# EAGLE design Lemming2_sensors (EAGLE 8.0.0)
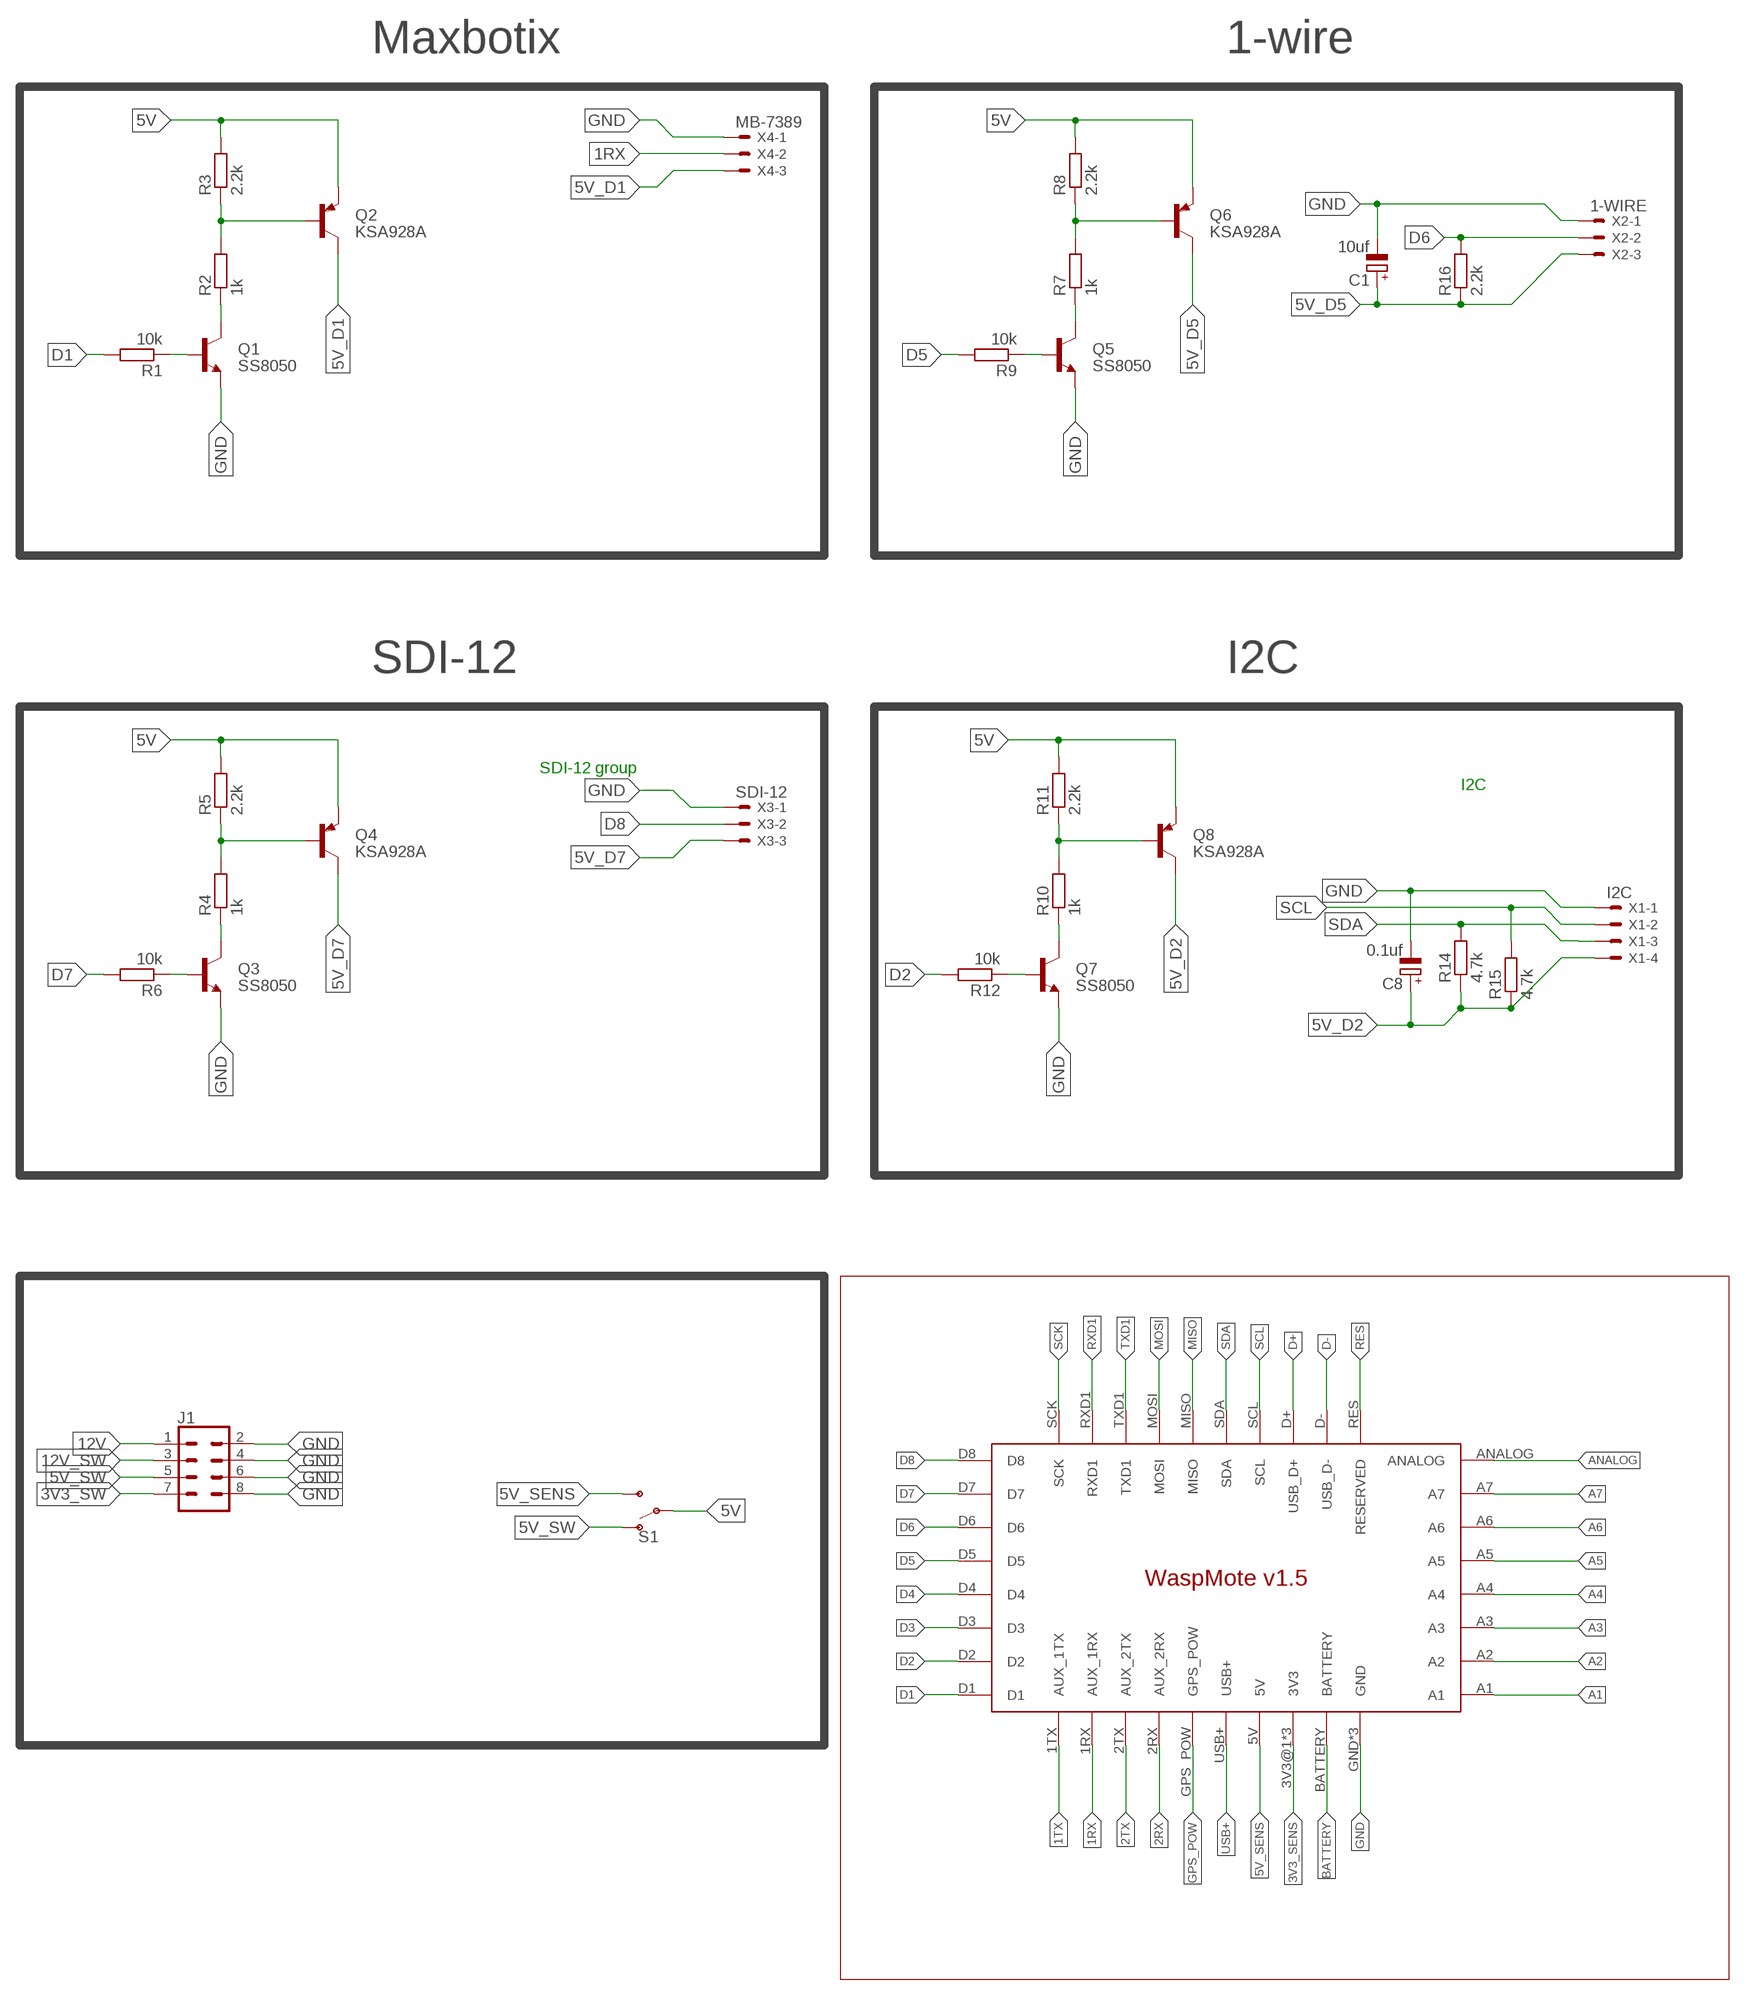
[diagram p0: schematic, sheet 1]

## Parts
C1  10uf  CPOL-EUE2.5-5  [E2,5-5]
C8  0.1uf  CPOL-EUE2.5-5  [E2,5-5]
J1  CONN_04X2  [2X4]
Q1  SS8050  [TO-92-EBC]
Q2  KSA928A  [TO-92-ECB]
Q3  SS8050  [TO-92-EBC]
Q4  KSA928A  [TO-92-ECB]
Q5  SS8050  [TO-92-EBC]
Q6  KSA928A  [TO-92-ECB]
Q7  SS8050  [TO-92-EBC]
Q8  KSA928A  [TO-92-ECB]
R1  10k  RESISTOR_R-EU_0309/10  [RESISTOR_0309/10]
R2  1k  RESISTOR_R-EU_0309/10  [RESISTOR_0309/10]
R3  2.2k  RESISTOR_R-EU_0309/10  [RESISTOR_0309/10]
R4  1k  RESISTOR_R-EU_0309/10  [RESISTOR_0309/10]
R5  2.2k  RESISTOR_R-EU_0309/10  [RESISTOR_0309/10]
R6  10k  RESISTOR_R-EU_0309/10  [RESISTOR_0309/10]
R7  1k  RESISTOR_R-EU_0309/10  [RESISTOR_0309/10]
R8  2.2k  RESISTOR_R-EU_0309/10  [RESISTOR_0309/10]
R9  10k  RESISTOR_R-EU_0309/10  [RESISTOR_0309/10]
R10  1k  RESISTOR_R-EU_0309/10  [RESISTOR_0309/10]
R11  2.2k  RESISTOR_R-EU_0309/10  [RESISTOR_0309/10]
R12  10k  RESISTOR_R-EU_0309/10  [RESISTOR_0309/10]
R14  4.7k  RESISTOR_R-EU_0309/10  [RESISTOR_0309/10]
R15  4.7k  RESISTOR_R-EU_0309/10  [RESISTOR_0309/10]
R16  2.2k  RESISTOR_R-EU_0309/10  [RESISTOR_0309/10]
S1  SWITCH-SPDT-PTH-11.6X4.0MM  [SWITCH_SPDT_PTH_11.6X4.0MM]
U$1  WASPMOTE_V1.5  [WASPMOTE_V1.5]
X1  I2C  22-23-2041  [22-23-2041]
X2  1-WIRE  22-23-2031  [22-23-2031]
X3  SDI-12  22-23-2031  [22-23-2031]
X4  MB-7389  22-23-2031  [22-23-2031]

## Nets
1RX: U$1.1RX(AUX_1RX) X4.2
1TX: U$1.1TX(AUX_1TX)
2RX: U$1.2RX(AUX_2RX)
2TX: U$1.2TX(AUX_2TX)
3V3_SENS: U$1.3V3@1(3V3) U$1.3V3@2(3V3) U$1.3V3@3(3V3)
3V3_SW: J1.7
5V: Q2.E Q4.E Q6.E Q8.E R3.2 R5.2 R8.2 R11.2 S1.2(P)
5V_D1: Q2.C X4.3
5V_D2: C8.+ Q8.C R14.1 R15.1 X1.4
5V_D5: C1.+ Q6.C R16.1 X2.3
5V_D7: Q4.C X3.3
5V_SENS: S1.3(S) U$1.5V
5V_SW: J1.5 S1.1(O)
12V: J1.1
12V_SW: J1.3
A1: U$1.A1
A2: U$1.A2
A3: U$1.A3
A4: U$1.A4
A5: U$1.A5
A6: U$1.A6
A7: U$1.A7
ANALOG: U$1.ANALOG
BATTERY: U$1.BATTERY
D1: R1.2 U$1.D1
D2: R12.2 U$1.D2
D3: U$1.D3
D4: U$1.D4
D5: R9.2 U$1.D5
D6: R16.2 U$1.D6 X2.2
D7: R6.2 U$1.D7
D8: U$1.D8 X3.2
D+: U$1.D+(USB_D+)
D-: U$1.D-(USB_D-)
GND: C1.- C8.- J1.2 J1.4 J1.6 J1.8 Q1.E Q3.E Q5.E Q7.E U$1.GND U$1.GND_2(GND) U$1.USB-(GND) X1.1 X2.1 X3.1 X4.1
GPS_POW: U$1.GPS_POW
MISO: U$1.MISO
MOSI: U$1.MOSI
N$1: Q4.B R4.2 R5.1
N$2: Q3.C R4.1
N$3: Q3.B R6.1
N$4: Q6.B R7.2 R8.1
N$5: Q5.C R7.1
N$6: Q5.B R9.1
N$7: Q8.B R10.2 R11.1
N$8: Q7.C R10.1
N$9: Q7.B R12.1
N$17: Q2.B R2.2 R3.1
N$27: Q1.C R2.1
N$28: Q1.B R1.1
RES: U$1.RES(RESERVED)
RXD1: U$1.RXD1
SCK: U$1.SCK
SCL: R15.2 U$1.SCL X1.2
SDA: R14.2 U$1.SDA X1.3
TXD1: U$1.TXD1
USB+: U$1.USB+

## Notes on the sheet
- Maxbotix | 1-wire
- SDI-12 | I2C
- SDI-12 group
- I2C

## Library data of the parts
C1 C8 = resistor:CPOL-EU: POLARIZED CAPACITOR, European symbol
J1 = SparkFun-Connectors:CONN_04X2: Multi connection point. Often used as Generic Header-pin footprint for 0.1 inch spaced/style header connections On any of the 0.1 inch spaced packages, you can populate with these: Break Away Headers - Straight <https://www.sparkfun.com/products/116> (PRT-00116) Break Away Male Headers - Right Angle <https://www.sparkfun.com/products/553> (PRT-00553) Female Headers <https://www.sparkfun.com/products/115> (PRT-00115) Break Away Headers - Machine Pin <https://www.sparkfun.com/products/117> (PRT-00117) Break Away Female Headers - Swiss Machine Pin <https://www.sparkfun.com/products/743> (PRT-00743)
Q1 Q3 Q5 Q7 = UIO-John:SS8050
Q2 Q4 Q6 Q8 = UIO-John:KSA928A
R1-R12 R14-R16 = Lemming2_sensors:RESISTOR_R-EU_: RESISTOR, European symbol
S1 = SparkFun-Switches:SWITCH-SPDT: Single Pole, Double Throw (SPDT) Switch Single-pole, double-throw (SPDT) switch. Variant Overview SMD-AYZ0202 Surface Mount DPDT Switch <https://www.sparkfun.com/products/597> (COM-00597) Used on e.g. LilyPad Arduino USB - ATmega32U4 Board <https://www.sparkfun.com/products/12049> PTH-11.6X4.0MM SPDT Mini Power Switch <https://www.sparkfun.com/products/102> (COM-00102) Used on e.g. SparkFun Simon Says - Through-Hole Soldering Kit <https://www.sparkfun.com/products/10547> (KIT-10547) PTH-11.6X4.0MM-KIT KIT version of SPDT Mini Power Switch - Simplifies soldering by removing tStop of switch pins - only one side can be soldered. PTH-11.6X4.0MM-LOCK LOCK version of SPDT Mini Power Switch - Offset pins hold switch in place for easier soldering. SMD-RIGHT-ANGLE Surface Mount Right Angle Switch <https://www.sparkfun.com/products/10860> (COM-10860) Used on e.g. SparkFun ESP8266 Thing <https://www.sparkfun.com/products/13231>; PROD_ID: SWCH-08261; SF_SKU: COM-00102
U$1 = UIO-John:WASPMOTE_V1.5: WaspMote v1.5 (c) 2017 john.hulth@geo.uio.no
X1 = con-molex:22-23-2041: .100" (2.54mm) Center Header - 4 Pin; MF: MOLEX; MPN: 22-23-2041; OC_FARNELL: 1462920; OC_NEWARK: 38C0355
X2-X4 = con-molex:22-23-2031: .100" (2.54mm) Center Header - 3 Pin; MF: MOLEX; MPN: 22-23-2031; OC_FARNELL: 1462950; OC_NEWARK: 30C0862

## Board
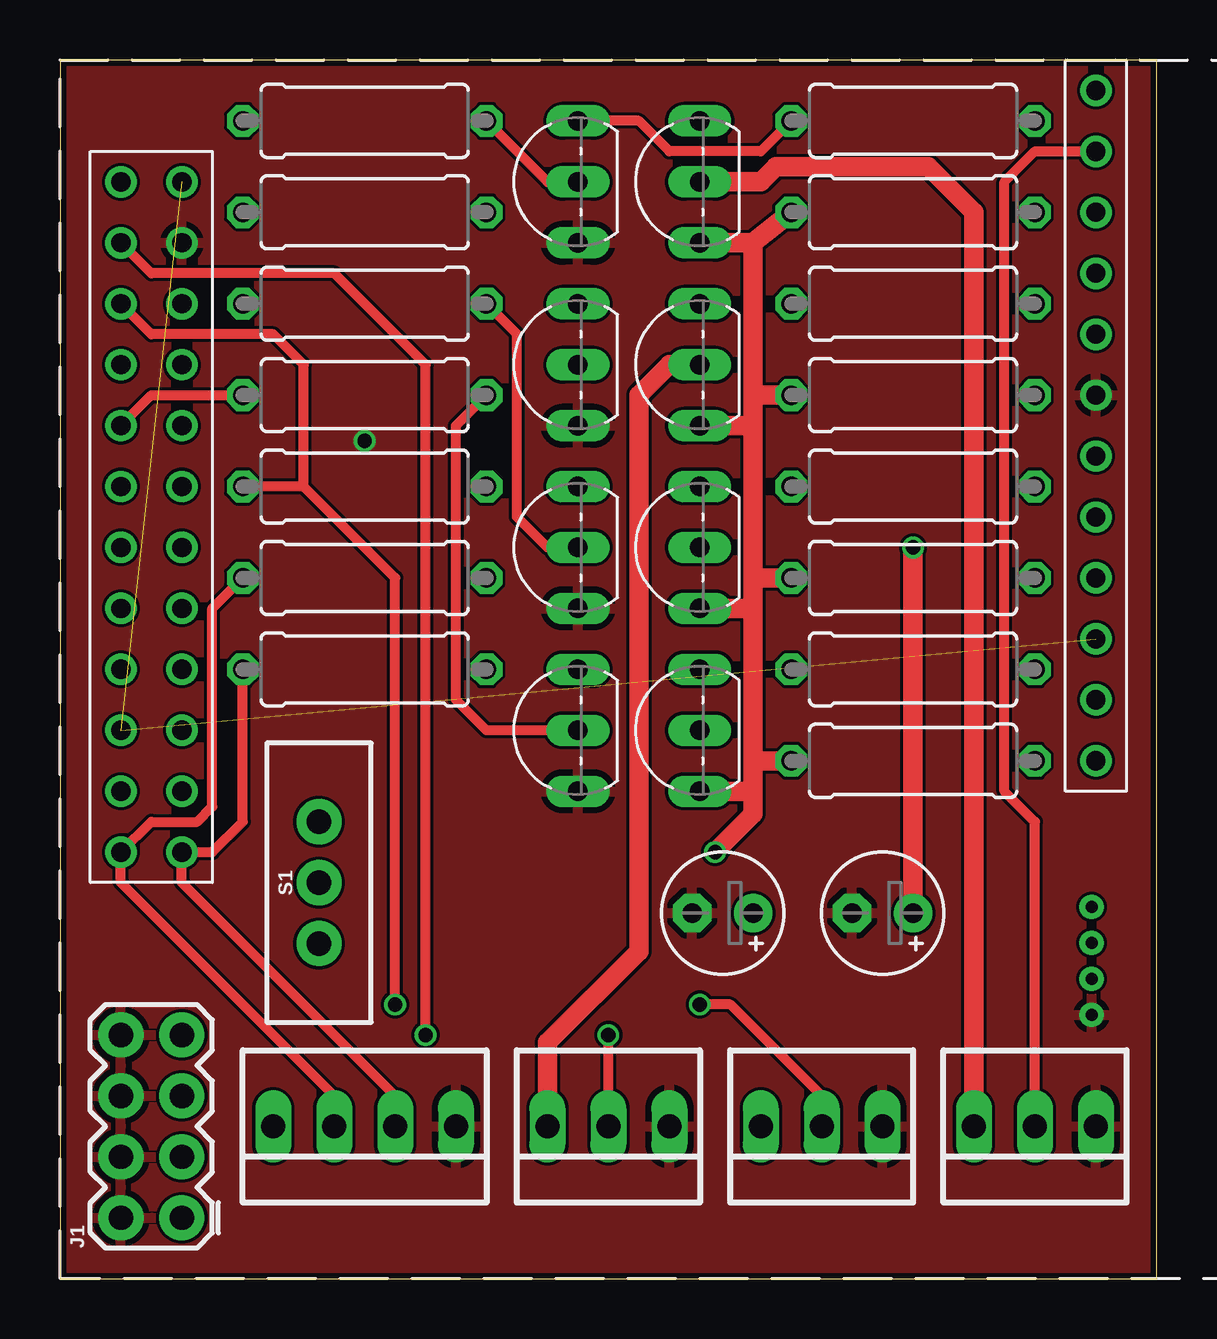
[diagram p1: board, top side]
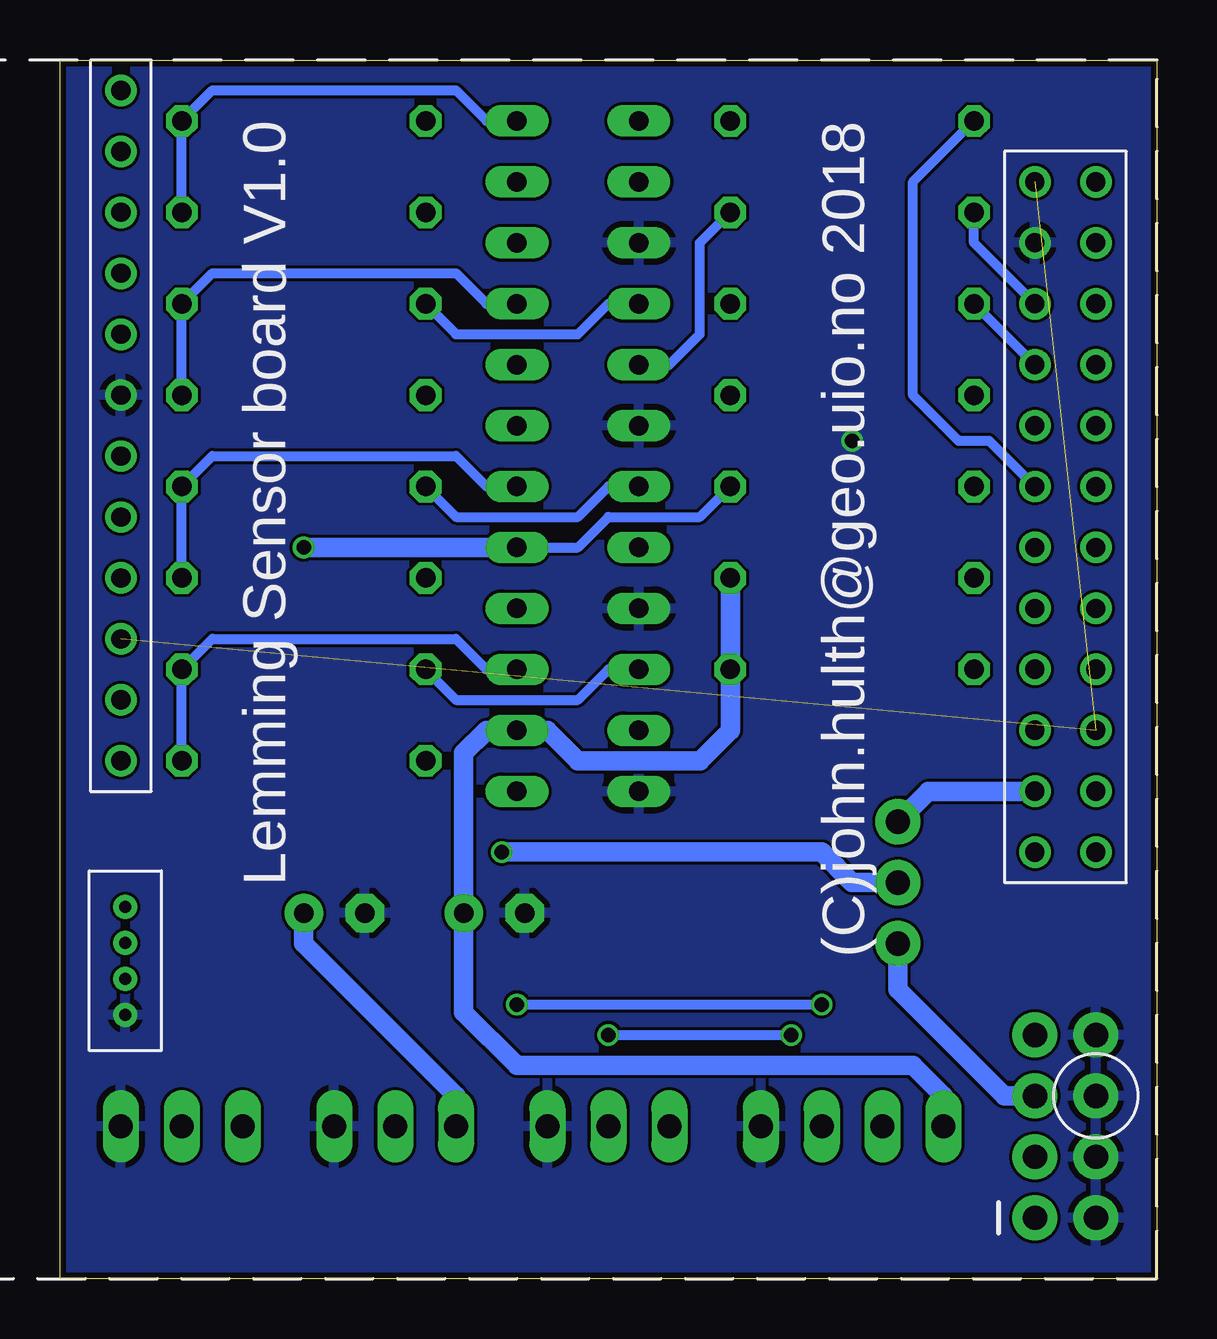
[diagram p2: board, bottom side, seen from below]

Size 45.72 x 50.8 mm. Coordinates in mm from the lower left corner, seen from the top.
Outline: 0,0 45.72,0 45.72,50.8 0,50.8 0,0
Copper layers (1*16): Top 0.035mm / dielectric 1.5mm / Bottom 0.035mm
Design rules "dirt_cheap_dirty_boards.v1": minimum track width 5mil, minimum drill 12mil, track to track 5mil, track to pad 5mil, pad to pad 5mil, via to via 5mil, smd to smd 0mil, copper to edge 10mil, drill to drill 10mil, minimum pad ring 10mil, minimum via ring 6mil, stop-mask expansion 2mil, vias tented up to drill 25mil, thermal gap 10mil

### Footprints (pad centres in the part's own frame; a part is rotated, then mirrored left to right if it is on the bottom)
E2,5-5 = drill 0.813 pad 1.6: + -1.27,0 | drill 0.813 pad 1.6 octagon: - 1.27,0
2X4 = drill 1.016 pad 1.88: 1 -3.81,-1.27; 2 -3.81,1.27; 3 -1.27,-1.27; 4 -1.27,1.27; 5 1.27,-1.27; 6 1.27,1.27; 7 3.81,-1.27; 8 3.81,1.27
TO-92-EBC = drill 0.813 long: B 0,0; C 2.54,0; E -2.54,0
TO-92-ECB = drill 0.813 long: B 2.54,0; C 0,0; E -2.54,0
RESISTOR_0309/10 = drill 0.813 octagon: 1 -5.08,0; 2 5.08,0
SWITCH_SPDT_PTH_11.6X4.0MM = drill 1.016 pad 1.88: 1 0,2.54; 2 0,0; 3 0,-2.54
WASPMOTE_V1.5 = drill 0.8: 1RX 43.18,46.99; 1TX 43.18,49.53; 2RX 43.18,44.45; 2TX 43.18,41.91; 3V3@1 5.08,45.72; 3V3@2 2.54,22.86; 3V3@3 43.18,26.67; 5V 5.08,20.32; A1 5.08,22.86; A2 2.54,25.4; A3 5.08,25.4; A4 2.54,27.94; A5 5.08,27.94; A6 2.54,30.48; A7 5.08,30.48; ANALOG 2.54,45.72; BATTERY 43.18,39.37; D1 5.08,33.02; D2 2.54,35.56; D3 5.08,35.56; D4 2.54,38.1; D5 5.08,38.1; D6 2.54,40.64; D7 5.08,40.64; D8 2.54,43.18; GND 5.08,43.18; GND_2 43.18,36.83; GPS_POW 2.54,20.32; MISO 43.18,21.59; MOSI 43.18,24.13; RES 2.54,33.02; RXD1 43.18,31.75; SCK 43.18,34.29; SCL 5.08,17.78; SDA 2.54,17.78; TXD1 43.18,29.21 | drill 0.5: D+ 43,12.5; D- 43,14; USB+ 43,15.5; USB- 43,11
22-23-2041 = drill 1 long: 1 -3.81,0; 2 -1.27,0; 3 1.27,0; 4 3.81,0
22-23-2031 = drill 1 long: 1 -2.54,0; 2 0,0; 3 2.54,0

### Placement (x,y rotation side)
C1  34.29,15.24 180 top
C8  27.62,15.24 180 top
J1  3.81,6.35 90 top
Q1  21.59,45.72 90 top
Q2  26.67,45.72 90 top
Q3  21.59,38.1 90 top
Q4  26.67,38.1 90 top
Q5  21.59,30.48 90 top
Q6  26.67,30.48 90 top
Q7  21.59,22.86 90 top
Q8  26.67,22.86 90 top
R1  12.7,48.26 180 top
R2  35.56,48.26 0 top
R3  35.56,44.45 180 top
R4  35.56,40.64 0 top
R5  35.56,36.83 180 top
R6  12.7,44.45 180 top
R7  35.56,33.02 0 top
R8  35.56,29.21 180 top
R9  12.7,40.64 180 top
R10  35.56,25.4 0 top
R11  35.56,21.59 180 top
R12  12.7,36.83 180 top
R14  12.7,29.21 180 top
R15  12.7,25.4 180 top
R16  12.7,33.02 180 top
S1  10.79,16.51 180 top
U$1  0,0 0 top
X1  12.7,6.35 180 top
X2  31.75,6.35 180 top
X3  22.86,6.35 180 top
X4  40.64,6.35 180 top

### Tracks (layer width: path | path; a pad name or v marks a point on that pad's centre or on a via)
1RX
  Top 0.406: U$1.1RX 40.64,46.99 39.37,45.72 39.37,20.32 40.64,19.05 X4.2
3V3_SENS  (2 unrouted)
5V  (via drill 0.6)
  Top 0.813: Q2.E 28.89,43.18 | 28.89,21.59 28.89,27.94 | 28.89,20.32 28.89,21.59 | 28.89,20.32 28.89,19.37 v27.3,17.78 | 28.89,29.21 28.89,35.56 | 28.89,29.21 28.89,27.94 | 28.89,36.83 28.89,43.18 | 28.89,36.83 28.89,35.56 | Q6.E 28.89,27.94 | R11.2 28.89,21.59 | Q8.E 28.89,20.32 | Q4.E 28.89,35.56 | R5.2 28.89,36.83 | R8.2 28.89,29.21 | 28.89,43.18 R3.2
  Bottom 0.813: v27.3,17.78 13.97,17.78 12.7,16.51 S1.2
5V_D1
  Top 0.813: Q2.C 29.21,45.72 29.84,46.35 36.2,46.35 38.1,44.45 X4.3
5V_D2
  Bottom 0.813: R14.1 R15.1 17.78,22.86 19.05,21.59 24.13,21.59 25.4,22.86 Q8.C 27.94,22.86 28.89,21.91 C8.+ 28.89,11.11 26.67,8.89 10.16,8.89 8.89,7.62 X1.4
5V_D5  (via drill 0.6)
  Top 0.813: v35.56,30.48 C1.+
  Bottom 0.406: Q6.C 24.13,30.48 22.86,31.75 19.05,31.75 R16.1
  Bottom 0.813: v35.56,30.48 Q6.C | C1.+ 35.56,13.97 29.21,7.62 X2.3
5V_D7
  Top 0.813: Q4.C 25.4,38.1 24.13,36.83 24.13,13.65 20.32,9.84 X3.3
5V_SENS
  Bottom 0.813: S1.3 9.53,20.32 U$1.5V
5V_SW
  Bottom 0.813: J1.5 6.35,7.62 10.79,12.06 S1.1
D1
  Bottom 0.406: U$1.D1 6.99,34.92 8.26,34.92 10.16,36.83 10.16,45.72 R1.2
D2
  Top 0.406: U$1.D2 3.81,36.83 R12.2
D5
  Bottom 0.406: U$1.D5 R9.2
D6  (via drill 0.6)
  Top 0.406: 10.16,33.02 10.16,38.1 8.89,39.37 3.81,39.37 U$1.D6 | 10.16,33.02 R16.2 | 10.16,33.02 13.97,29.21 v13.97,11.43 | v26.67,11.43 27.94,11.43 31.75,7.62 X2.2
  Bottom 0.406: v26.67,11.43 v13.97,11.43
D7
  Bottom 0.406: U$1.D7 7.62,43.18 R6.2
D8  (via drill 0.6)
  Top 0.406: v15.24,10.16 15.24,38.1 11.43,41.91 3.81,41.91 U$1.D8 | X3.2 v22.86,10.16
  Bottom 0.406: v22.86,10.16 v15.24,10.16
GND  (via drill 0.6)
  other vias: 12.7,34.92
  pour Bottom: 0,50.8 45.72,50.8 45.72,0 0,0
  pour Top: 0,50.8 0,0 45.72,0 45.72,50.8
N$1
  Bottom 0.406: Q4.B 27.94,40.64 29.21,41.91 39.37,41.91 R4.2 R5.1
N$2
  Bottom 0.406: R4.1 29.21,39.37 24.13,39.37 22.86,40.64 Q3.C
N$3
  Bottom 0.406: Q3.B 20.32,38.1 19.05,39.37 19.05,43.18 R6.1
N$4
  Bottom 0.406: R8.1 R7.2 39.37,34.29 29.21,34.29 27.94,33.02 Q6.B
N$5
  Bottom 0.406: R7.1 29.21,31.75 24.13,31.75 22.86,33.02 Q5.C
N$6
  Top 0.406: Q5.B 20.32,30.48 19.05,31.75 19.05,39.37 R9.1
N$7
  Bottom 0.406: R11.1 R10.2 39.37,26.67 29.21,26.67 27.94,25.4 Q8.B
N$8
  Bottom 0.406: R10.1 29.21,24.13 24.13,24.13 22.86,25.4 Q7.C
N$9
  Top 0.406: Q7.B 17.78,22.86 16.51,24.13 16.51,35.56 R12.1
N$17
  Bottom 0.406: R3.1 R2.2 39.37,49.53 29.21,49.53 27.94,48.26 Q2.B
N$27
  Top 0.406: R2.1 29.21,46.99 25.4,46.99 24.13,48.26 Q1.C
N$28
  Top 0.406: Q1.B 20.32,45.72 R1.1
SCL
  Top 0.406: R15.2 7.62,19.05 6.35,17.78 U$1.SCL 5.08,16.51 13.97,7.62 X1.2
SDA
  Top 0.406: R14.2 6.35,27.94 6.35,19.68 5.71,19.05 3.81,19.05 U$1.SDA 2.54,16.51 11.43,7.62 X1.3

### Text on the board
bNames: (C)john.hulth@geo.uio.no 2018 | Lemming Sensor board V1.0
tValues: 5V_SENS | 5V_SW | +5V | SDA | SCL | GND | +5V | D8 | GND | +5V | D6 | GND | +5V | 1RX | GND